# Altium project T1-T0ast.X3.PrjPcb (part 1 of 3)
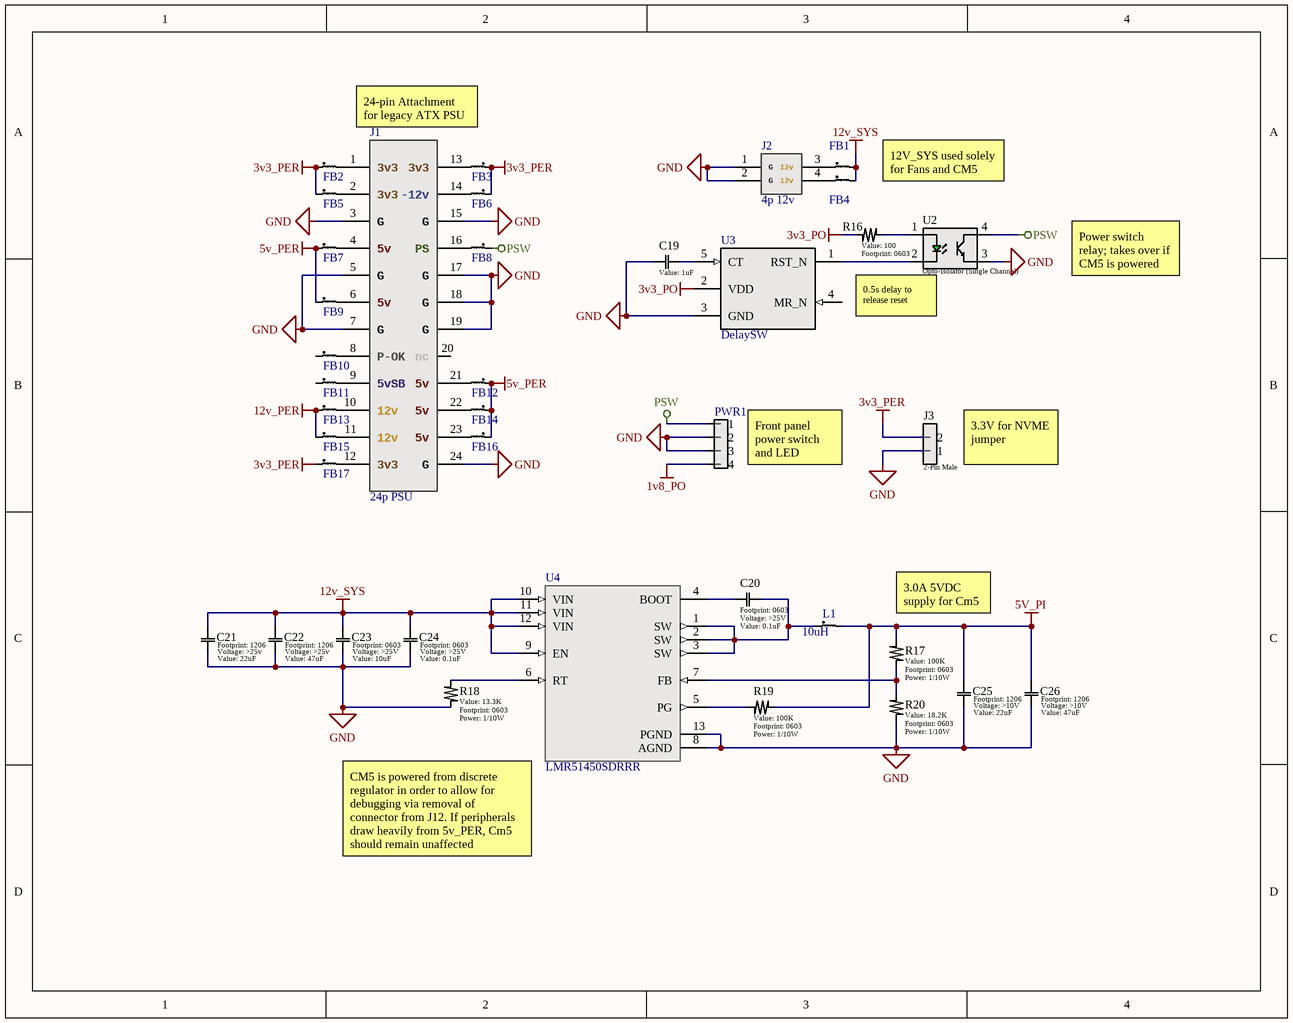
[diagram p0: Power_Regulation.SchDoc]
10 sheets, 431 parts. Net scope: global (net labels, ports and power ports of the same name join across sheets).
Board file: T1-T0ast.PcbDoc
Sheets:
  Power_Regulation.SchDoc
  Docking_Connection.SchDoc
  USB2_Replication.SchDoc
  USB_Audio.SchDoc
  USB_SATA.SchDoc
  RJ45_Ethernet.SchDoc
  HDMI.SchDoc
  SD_Card.SchDoc
  USB3_Replication.SchDoc
  M2_USB_SATA.SchDoc

## Sheet Power_Regulation.SchDoc
size A; SheetNumber: 2; SheetTotal: 11

### Parts
C19  value 1uF  [0603]  (hidden comment: Generic Capacitor)
C20  value 0.1uF  Voltage: >25V  [0603]  (hidden comment: Generic Capacitor)
C21  value 22uF  Voltage: >25v  [1206]  (hidden comment: Generic Capacitor)
C22  value 47uF  Voltage: >25v  [1206]  (hidden comment: Generic Capacitor)
C23  value 10uF  Voltage: >25V  [0603]  (hidden comment: Generic Capacitor)
C24  value 0.1uF  Voltage: >25V  [0603]  (hidden comment: Generic Capacitor)
C25  value 22uF  Voltage: >10V  [1206]  (hidden comment: Generic Capacitor)
C26  value 47uF  Voltage: >10V  [1206]  (hidden comment: Generic Capacitor)
FB1  1206 Ferrite  [1206]  (value not drawn)
FB2  1206 Ferrite  [1206]  (value not drawn)
FB3  1206 Ferrite  [1206]  (value not drawn)
FB4  1206 Ferrite  [1206]  (value not drawn)
FB5  1206 Ferrite  [1206]  (value not drawn)
FB6  1206 Ferrite  [1206]  (value not drawn)
FB7  1206 Ferrite  [1206]  (value not drawn)
FB8  1206 Ferrite  [1206]  (value not drawn)
FB9  1206 Ferrite  [1206]  (value not drawn)
FB10  1206 Ferrite  [1206]  (value not drawn)
FB11  1206 Ferrite  [1206]  (value not drawn)
FB12  1206 Ferrite  [1206]  (value not drawn)
FB13  1206 Ferrite  [1206]  (value not drawn)
FB14  1206 Ferrite  [1206]  (value not drawn)
FB15  1206 Ferrite  [1206]  (value not drawn)
FB16  1206 Ferrite  [1206]  (value not drawn)
FB17  1206 Ferrite  [1206]  (value not drawn)
J1  24p PSU  [CONN_442060007_MOL]
J2  4p 12v  [CON_39281043]
J3  2-Pin Male  [0022057025]
L1  10uH  [SMD 8.2x8.6mm]
PWR1  4-Pin Male Header (0.100" Pitch)  [TSW-104-07-T-S]  (value not drawn)
R16  value 100  [0603]  (hidden comment: Generic Resistor)
R17  value 100K  Power: 1/10W  [0603]  (hidden comment: Generic Resistor)
R18  value 13.3K  Power: 1/10W  [0603]  (hidden comment: Generic Resistor)
R19  value 100K  Power: 1/10W  [0603]  (hidden comment: Generic Resistor)
R20  value 18.2K  Power: 1/10W  [0603]  (hidden comment: Generic Resistor)
U2  Opto-Isolator (Single Channel)  [4-SMD (7.62mm Gull-Wing) Opto-Transistor]
U3  DelaySW  [TSOT-23-5]
U4  LMR51450SDRRR  [WSON-12]

### Nets
1v8_PO: PWR1.4
3v3_PER: FB2.1 FB3.1 FB5.1 FB6.1 FB17.1 J3.2
3v3_PO: R16.1 U3.2(VDD)
5v_PER: FB7.1 FB9.1 FB12.1 FB14.1 FB16.1
5V_PI: C25.1 C26.1 L1.2 R17.2 R19.1
12v_PER: FB13.1 FB15.1
12v_SYS: C21.1 C22.1 C23.1 C24.1 FB1.2 FB4.2 U4.9(EN) U4.10(VIN) U4.11(VIN) U4.12(VIN)
GND: C19.2 C21.2 C22.2 C23.2 C24.2 C25.2 C26.2 J1.3(G) J1.5(G) J1.7(G) J1.15(G) J1.17(G) J1.18(G) J1.19(G) J1.24(G) J2.1(G) J2.2(G) J3.1 PWR1.2 PWR1.3 R18.1 R20.1 U2.3 U3.3(GND) U4.8(AGND) U4.13(PGND)
PSW: FB8.1 PWR1.1 U2.4
NetC19_1: C19.1 U3.5(CT)
NetC20_1: C20.1 U4.4(BOOT)
NetC20_2: C20.2 L1.1 U4.1(SW) U4.2(SW) U4.3(SW)
NetFB1_1: FB1.1 J2.3(12v)
NetFB2_2: FB2.2 J1.1(3v3)
NetFB3_2: FB3.2 J1.13(3v3)
NetFB4_1: FB4.1 J2.4(12v)
NetFB5_2: FB5.2 J1.2(3v3)
NetFB6_2: FB6.2 J1.14(-12v)
NetFB7_2: FB7.2 J1.4(5v)
NetFB8_2: FB8.2 J1.16(PS)
NetFB9_2: FB9.2 J1.6(5v)
NetFB10_2: FB10.2 J1.8(P-OK)
NetFB11_2: FB11.2 J1.9(5vSB)
NetFB12_2: FB12.2 J1.21(5v)
NetFB13_2: FB13.2 J1.10(12v)
NetFB14_2: FB14.2 J1.22(5v)
NetFB15_2: FB15.2 J1.11(12v)
NetFB16_2: FB16.2 J1.23(5v)
NetFB17_2: FB17.2 J1.12(3v3)
NetR16_2: R16.2 U2.1
NetR17_1: R17.1 R20.2 U4.7(FB)
NetR18_2: R18.2 U4.6(RT)
NetR19_2: R19.2 U4.5(PG)
NetU2_2: U2.2 U3.1(RST_N)

Not connected (* = marked no-connect by the designer): FB10 1; FB11 1; J1 20(nc); U3 4(MR_N)

### Notes on the sheet
- 24-pin Attachment for legacy ATX PSU
- 12V_SYS used solely for Fans and CM5
- Power switch relay; takes over if CM5 is powered
- (near U2) 0.5s delay to release reset
- (near PWR1) Front panel power switch and LED
- (near J3) 3.3V for NVME jumper
- (near R17) 3.0A 5VDC supply for Cm5
- (near U4) CM5 is powered from discrete regulator in order to allow for debugging via removal of connector from J12. If peripherals draw heavily from 5v_PER, Cm5 should remain unaffected
- REV
- REVISIONS
- DATE
- DESCRIPTION
- BY
- UNLESS OTHERWISE SPECIFIED, DRAWING DEFINITIONS AND TOLERANCES SHALL BE FOUND UNDER SUPPLIER STANDARDS SS-001. THIS PART AND ALL COMPONENTS OF IT MUST BE RoHS & REACH COMPLIANT. A CERTIFICATE OF COMPLIANCE MUST BE PROVIDED UPON REQUEST.
- ALL INFORMATION ON THIS DOCUMENT IS THE SOLE PROPERTY OF GAMBER-JOHNSON AND SHALL NOT BE COPIED, REPRODUCED, USED OR DISCLOSED IN WHOLE OR IN PART WITHOUT THE WRITTEN CONSENT OF GAMBER-JOHNSON
- TOLERANCES
  .00 ± .060
  .000 ± .020
  .0000 ± .005
  ANGELS ± 1°
- DRAWN BY:
- PROJECT NUMBER:
- SHEET TITLE:
- SHEET
- OF
- DATE:
- LOCATION:
- ASSEMBLY NUMBER
- SIZE
- GAMBER-JOHNSON LLC
  5001 JOERNS DR.
  STEVENS POINT, WI 54481
  +1 (715) 344-5209
- B

### Library data of the parts
C19 = Generic Capacitor: Voltage: 10V; Tolerance: 10%
C20 C23 C24 C26 = Generic Capacitor: Tolerance: 10%
C21 C22 C25 = Generic Capacitor: Tolerance: 20%
FB1-FB17 = HI1206T161R-10: 160 Ohms @ 100MHz 1 Power, Signal Line Ferrite Bead 1206 (3216 Metric) 6A 18mOhm; Manufacturer 1: Laird Steward; DC Resistance (DCR): 18mR; Number of Lines: 1; Impedance: 160R; Supplier 1: Digi-Key; Manufacturer Part Number 1: HI1206T161R-10; RoHS: Yes; Category: Fixed Inductors; Stock 1: 250713; Pricing 1: 1=0.20000, 10=0.15600, 25=0.12920, 50=0.11140, 100=0.10020, 250=0.08464, 500=0.07572, 1000=0.06458 (USD); Mount: Surface Mount; Case/Package: 1206; Weight: 0.0136oz; Case Code (Metric): 3216; Case Code (Imperial): 1206; Core Material: Ferrite; Material: Ferrite; Min Operating Temperature: -40°C; Max Operating Temperature: 125°C; Package Quantity: 1; Packaging: Tape and Reel; Max Current Rating: 6A; Current Rating: 6A; Max DC Current: 6A; Termination: SMD/SMT; Frequency: 100MHz; Test Frequency: 100MHz; Length: 3.2mm; Height: 0.071inch; Width: 0.063inch; Depth: 1.8mm; Lead Free: Lead Free; REACH SVHC: Unknown; ComponentLink1URL: https://datasheet.ciiva.com/22622/1685743-22622771.pdf?src-supplier=Element14; ComponentLink1Description: https://datasheet.ciiva.com/22622/1685743-22622771.pdf?src-supplier=Element14; ComponentLink2URL: https://datasheet.ciiva.com/16714/70065439-16714326.pdf?src-supplier=Allied+Electronics; ComponentLink2Description: https://datasheet.ciiva.com/16714/70065439-16714326.pdf?src-supplier=Allied+Electronics; Supplier Part Number 1: 240-2411-1-ND; LCSC PN: C2926396
J1 = 442060007: Connector Header Through Hole 24 position 0.165" (4.20mm); Mfr_Name: Molex Connector Corporation; RefDes: RefDes; Type: Type; Supplier 1: Mouser; Supplier Part Number 1: 538-44206-0007; LCSC PN: C7541562
J2 = 39281043: Connector Header Through Hole 4 position 0.165" (4.20mm); Mfr_Name: Molex Connector Corporation; RefDes: RefDes; Type: Type; Supplier 1: Avnet; Supplier Part Number 1: 0039281043; LCSC PN: C2845777
J3 = 0022057025: Conn Shrouded Header (4 Sides) HDR 2 POS 2.5mm Solder RA Thru-Hole SPOX™ Bag; Manufacturer 1: Molex; Number of Poles: 2; Voltage Rating: 250V; Contact Resistance: 20mR; Max Voltage Rating (DC): 250.25kV; Max Voltage Rating (AC): 125V; Current Rating: 3A; Insulation Resistance: 1GR; Connector Type: Male Pin; Shrouded: Yes (With); Test Voltage: 1kV; Glow Wire Compliant: Non-compliant; Supplier 1: RSComponents; Manufacturer Part Number 1: 22-05-7025; RoHS: Yes; Category: Headers and Wire Housings; Stock 1: 1440; Pricing 1: 10=0.40100, 250=0.36000, 1000=0.24900, 5000=0.22200, 10000=0.20700 (USD); Mount: Through Hole,Surface Mount; Contact Plating: Tin,Copper; Contact Material: Brass,Bronze; Housing Color: Natural; Housing Material: Nylon; Color: Natural; Material: Nylon,Polyamide; Insulation Material: Nylon; Min Operating Temperature: -40°C; Max Operating Temperature: 105°C; Packaging: Bulk; Gender: Male; Number of Rows: 1; Termination: Solder; Number of Contacts: 2; Orientation: Right Angle; Package Quantity: 1; Voltage Rating (AC): 250V; Number of Positions: 2; Working Voltage: 250V; Voltage Rating (DC): 250V; Number of Circuits: 2; Contact Gender: Male; Series: SPOX™ 5268; Contact Type: Male Pin; Length: 7.65mm; Height: 5.7mm; Pitch: 2.5mm; Depth: 5.1mm; Lead Pitch: 2.5mm; Contact Mating Length: 0.138inch; Radiation Hardening: No; RoHS Compliant: Yes; REACH SVHC: Unknown; Lead Free: Lead Free; Flammability Rating: UL94 V-0; ComponentLink1URL: https://datasheet.ciiva.com/711/022057025-sd-711958.pdf?src-supplier=Digi-Key; ComponentLink1Description: https://datasheet.ciiva.com/711/022057025-sd-711958.pdf?src-supplier=Digi-Key; ComponentLink2URL: https://datasheet.ciiva.com/25265/1766960-25265813.pdf?src-supplier=Newark; ComponentLink2Description: https://datasheet.ciiva.com/25265/1766960-25265813.pdf?src-supplier=Newark; ComponentLink3URL: https://datasheet.ciiva.com/5155/0022057025-pcb-headers-158480-5155683.pdf?src-supplier=Mouser; ComponentLink3Description: https://datasheet.ciiva.com/5155/0022057025-pcb-headers-158480-5155683.pdf?src-supplier=Mouser; ComponentLink4URL: https://datasheet.ciiva.com/19461/2017869-19461071.pdf?src-supplier=Jameco; ComponentLink4Description: https://datasheet.ciiva.com/19461/2017869-19461071.pdf?src-supplier=Jameco; ComponentLink5URL: https://datasheet.ciiva.com/11747/0900766b80da772b-11747276.pdf?src-supplier=RSComponents; ComponentLink5Description: https://datasheet.ciiva.com/11747/0900766b80da772b-11747276.pdf?src-supplier=RSComponents; ComponentLink6URL: https://datasheet.ciiva.com/7920/1877911-7920684.pdf?src-supplier=Element14; ComponentLink6Description: https://datasheet.ciiva.com/7920/1877911-7920684.pdf?src-supplier=Element14; ComponentLink7URL: https://datasheet.ciiva.com/9468/0022057025-pcb-headers-9468379.pdf?src-supplier=Avnet; ComponentLink7Description: https://datasheet.ciiva.com/9468/0022057025-pcb-headers-9468379.pdf?src-supplier=Avnet; Supplier Part Number 1: 6878086; LCSC PN: C918490
L1 = IHLP3232DZER100M5A: 5.1A 10uH ±20% 5.2A - Power Inductor; Mfr_Name: Vishay; Type: DEV; Copyright: Copyright (C) 2023 Ultra Librarian. All rights reserved.; Manufacturer_Part_Number: IHLP3232DZER100M5A; RefDes: RefDes; LCSC PN: C2051768; Supplier 1: Mouser
PWR1 = TSW-104-07-T-S: Connector Header Through Hole 4 position 0.100" (2.54mm); Manufacturer 1: Samtec; Manufacturer Part Number 1: MTSW-104-07-T-S-170; Number of Contacts: 4; Supplier 1: Avnet; RoHS: Yes; Category: Connectors; Mount: Through Hole; Contact Plating: Tin; Contact Material: Bronze; Min Operating Temperature: -55°C; Max Operating Temperature: 105°C; Number of Rows: 1; Termination: Solder; Gender: Male; Packaging: Bulk; Orientation: Vertical; Pitch: 2.54mm; Radiation Hardening: No; RoHS Compliant: Yes; Lead Free: Lead Free; ComponentLink1URL: http://www.samtec.com/documents/webfiles/pdf/HMTSW.PDF?src-supplier=Avnet; ComponentLink1Description: http://www.samtec.com/documents/webfiles/pdf/HMTSW.PDF?src-supplier=Avnet; Supplier Part Number 1: MTSW-104-07-T-S-170
R16 = Generic Resistor: Tolerance: 1%; Power: 1/10W
R17-R20 = Generic Resistor: Tolerance: 1%
U2 = LTV-816S: LTV Series Single Channel 80 V 5000 Vrms Transistor Output Optocoupler SMT-DIP-4; Manufacturer: Vishay Lite-On; Manufacturer Part Number: LTV-816S-TA1; Number of Channels: 1; Forward Voltage: 1.4V; Collector Emitter Voltage (VCEO): 80V; Rise Time: 18000ns; Output Current per Channel: 50mA; Collector Emitter Saturation Voltage: 200mV; Current Transfer Ratio: 320%; Isolation Voltage: 5kV; Input Type: DC; Max Power Dissipation: 200mW; Reverse Breakdown Voltage: 6V; Supplier 1: Digi-Key; RoHS: Yes; Category: Optocouplers; Stock 1: 2; Pricing 1: 1=0.45000, 10=0.27600, 100=0.15870 (USD); Mount: Surface Mount; Case/Package: SMD/SMT; Number of Pins: 4; Min Operating Temperature: -50°C; Max Operating Temperature: 110°C; Max Output Voltage: 80V; Packaging: Tape and Reel; Forward Current: 50mA; Fall Time: 18000ns; Max Input Current: 50mA; Collector-emitter Voltage-Max: 200mV; Series: -; Max Collector Current: 50mA; Number of Elements: 1; Power Dissipation: 200mW; Package Quantity: 1000; Output Voltage: 80V; Number of Circuits: 1; Isolation Voltage-Max: 5kV; Radiation Hardening: No; RoHS Compliant: Yes; Lead Free: Lead Free; ComponentLink1URL: https://datasheet.ciiva.com/15119/getdatasheetpartid-317372-15119066.pdf?src-supplier=Verical; ComponentLink1Description: https://datasheet.ciiva.com/15119/getdatasheetpartid-317372-15119066.pdf?src-supplier=Verical; ComponentLink2URL: https://datasheet.ciiva.com/6573/s-110-ltv-816826846m-s-s-ta-s-ta1-s-tpseries-6573992.pdf?src-supplier=Digi-Key; ComponentLink2Description: https://datasheet.ciiva.com/6573/s-110-ltv-816826846m-s-s-ta-s-ta1-s-tpseries-6573992.pdf?src-supplier=Digi-Key; ComponentLink3URL: https://datasheet.ciiva.com/6573/s-110-ltv-816826846m-s-s-ta-s-ta1-s-tpseries-6573991.pdf?src-supplier=Digi-Key; ComponentLink3Description: https://datasheet.ciiva.com/6573/s-110-ltv-816826846m-s-s-ta-s-ta1-s-tpseries-6573991.pdf?src-supplier=Digi-Key; ComponentLink4URL: https://datasheet.ciiva.com/6573/s-110-ltv-816826846m-s-s-ta-s-ta1-s-tpseries-6573993.pdf?src-supplier=Digi-Key; ComponentLink4Description: https://datasheet.ciiva.com/6573/s-110-ltv-816826846m-s-s-ta-s-ta1-s-tpseries-6573993.pdf?src-supplier=Digi-Key; Supplier Part Number 1: 160-1892-1-ND; LCSC PN: C92647
U3 = TPS3840DL22DBVR: Supervisor Open Drain or Open Collector 1 Channel SOT-23-5 / 2.2V Threshold; Mfr_Name: Texas Instruments; TYPE: TYPE; RefDes: RefDes; LCSC PN: C2867913; Supplier 1: Mouser; Supplier Part Number 1: 595-TPS3840DL22DBVR
U4 = LMR51450SDRRR: 36-V, 5-A synchronous buck converter; MF: Texas Instruments; SnapEDA_Link: https://www.snapeda.com/parts/LMR51450SDRRR/Texas+Instruments/view-part/?ref=snap; Package: WSON-12 Texas Instruments; Value: *; MP: LMR51450SDRRR; Check_prices: https://www.snapeda.com/parts/LMR51450SDRRR/Texas+Instruments/view-part/?ref=eda; LCSC PN: C6890985

## Sheet Docking_Connection.SchDoc
size B; SheetNumber: 3; SheetTotal: 11
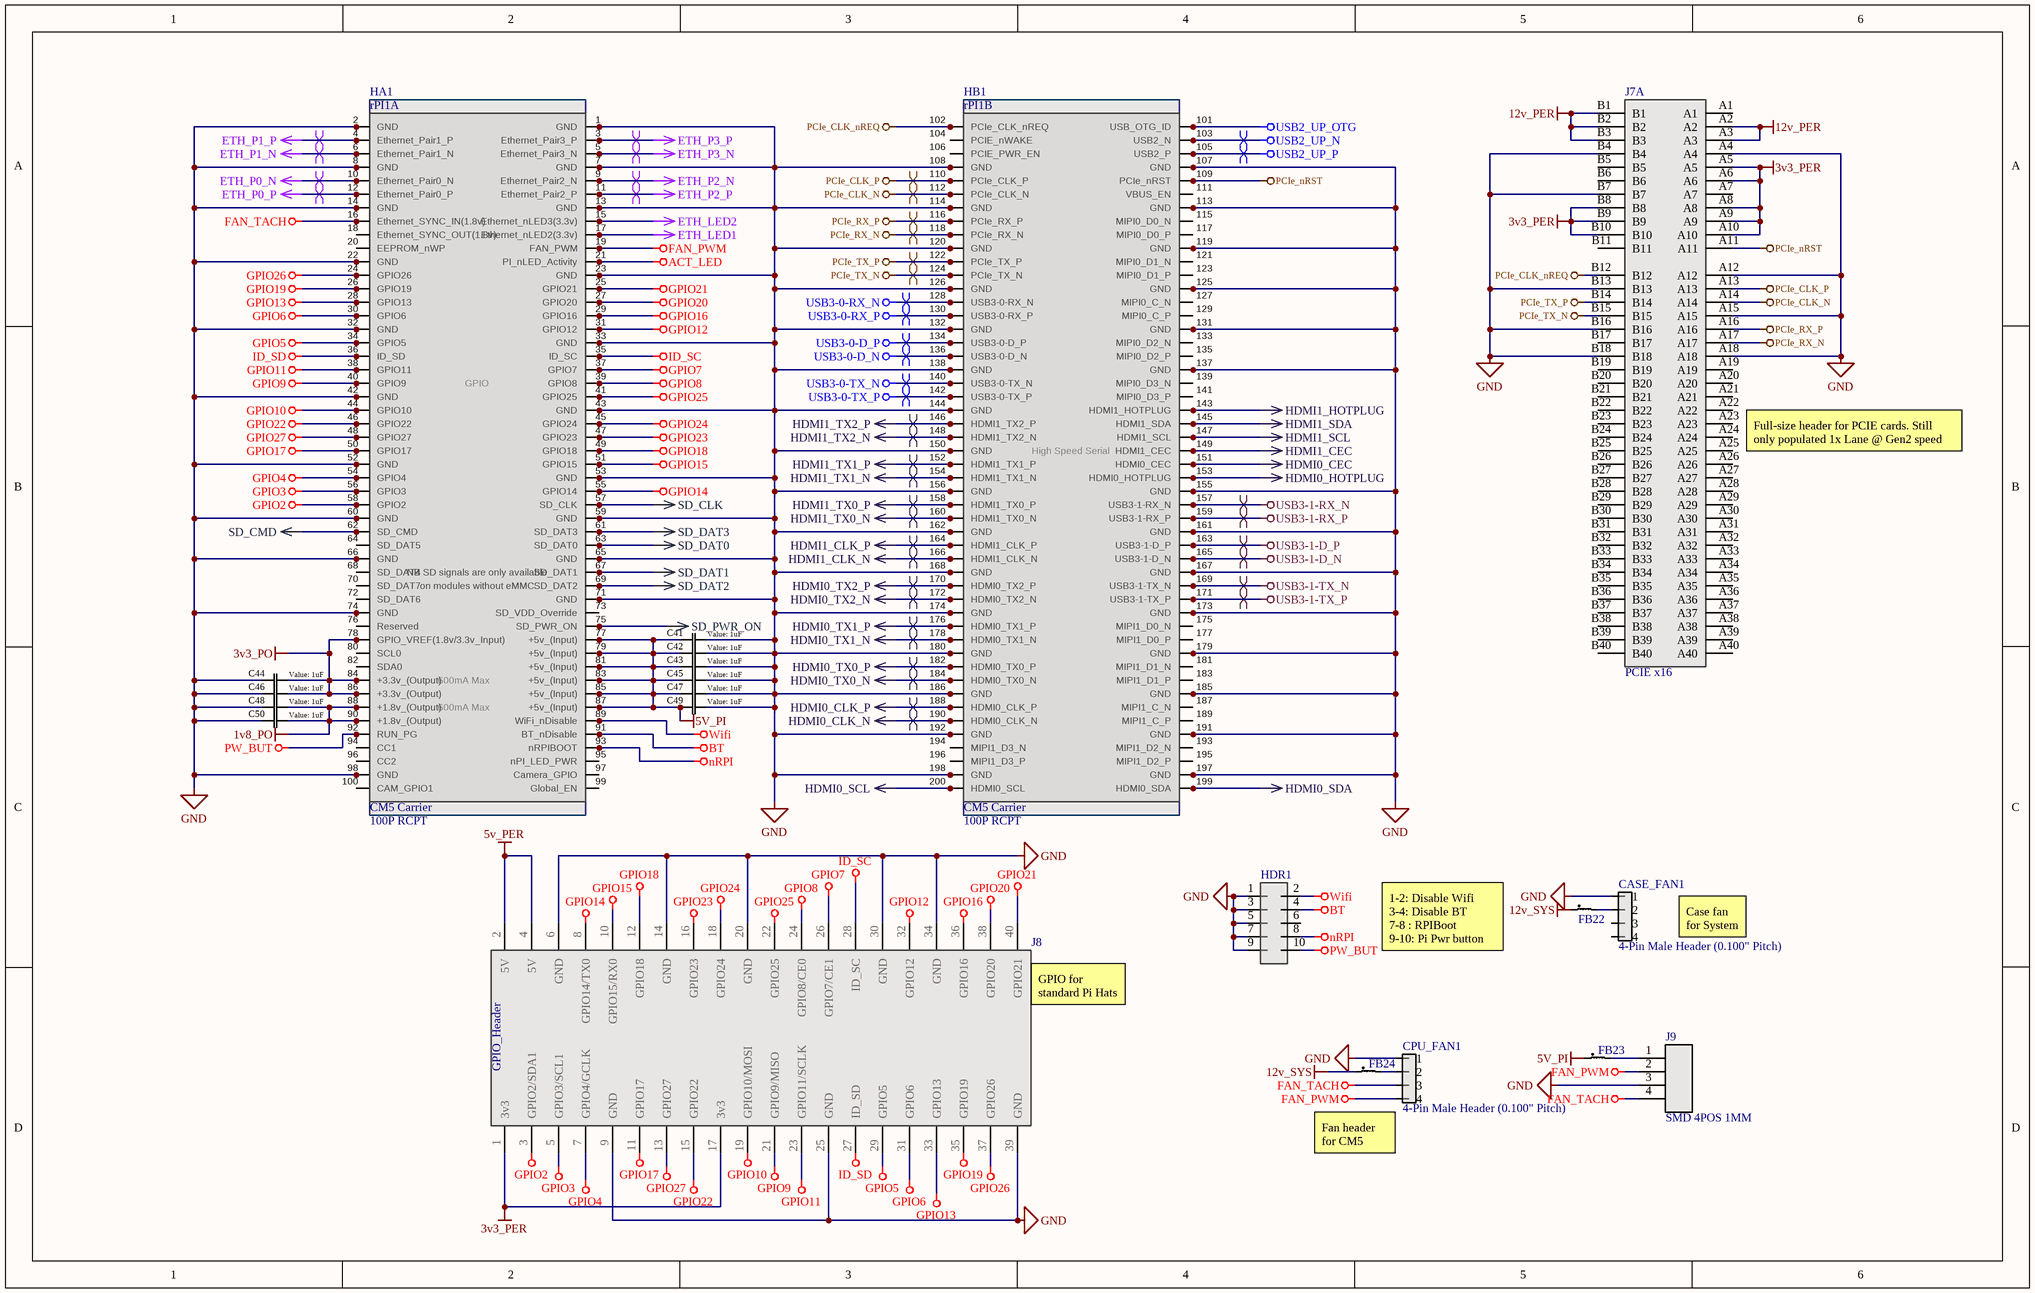
[diagram p1: Docking_Connection.SchDoc]

### Parts
C41  value 1uF  [0603]  (hidden comment: Generic Capacitor)
C42  value 1uF  [0603]  (hidden comment: Generic Capacitor)
C43  value 1uF  [0603]  (hidden comment: Generic Capacitor)
C44  value 1uF  [0603]  (hidden comment: Generic Capacitor)
C45  value 1uF  [0603]  (hidden comment: Generic Capacitor)
C46  value 1uF  [0603]  (hidden comment: Generic Capacitor)
C47  value 1uF  [0603]  (hidden comment: Generic Capacitor)
C48  value 1uF  [0603]  (hidden comment: Generic Capacitor)
C49  value 1uF  [0603]  (hidden comment: Generic Capacitor)
C50  value 1uF  [0603]  (hidden comment: Generic Capacitor)
CASE_FAN1  4-Pin Male Header (0.100" Pitch)  [TSW-104-07-T-S]
CPU_FAN1  4-Pin Male Header (0.100" Pitch)  [TSW-104-07-T-S]
FB22  0603 Ferrite  [0603]  (value not drawn)
FB23  0603 Ferrite  [0603]  (value not drawn)
FB24  0603 Ferrite  [0603]  (value not drawn)
HA1  100P RCPT  [DF40HC(3.0)-100DS-0.4V(51)]
HB1  100P RCPT  [DF40HC(3.0)-100DS-0.4V(51)]
HDR1  10pinMobo  [10pinMobo]  (value not drawn)
J7  PCIE x16  [10018783-10203TLF]  (part A of 2)
J8  rPi Zero Carrier  [rPiHeader]  (value not drawn)
J9  SMD 4POS 1MM  [CONN4_BM04B-SRSS_JST]
rPI1  CM5 Carrier  [CM4-FTPD]  (parts A,B of 2)

### Nets
1v8_PO: C48.1 C50.1 HA1.88 HA1.90 rPI1.88(+1.8v_(Output)) rPI1.90(+1.8v_(Output))
3v3_PER: J7.A5 J7.A6 J7.A8 J7.A9 J7.A10 J7.B8 J7.B9 J7.B10 J8.1(3v3) J8.17(3v3)
3v3_PO: C44.1 C46.1 HA1.78 HA1.84 HA1.86 rPI1.78(GPIO_VREF(1.8v/3.3v_Input)) rPI1.84(+3.3v_(Output)) rPI1.86(+3.3v_(Output))
5v_PER: J8.2(5V) J8.4(5V)
5V_PI: C41.2 C42.2 C43.2 C45.2 C47.2 C49.2 FB23.1 HA1.77 HA1.79 HA1.81 HA1.83 HA1.85 HA1.87 rPI1.77(+5v_(Input)) rPI1.79(+5v_(Input)) rPI1.81(+5v_(Input)) rPI1.83(+5v_(Input)) rPI1.85(+5v_(Input)) rPI1.87(+5v_(Input))
12v_PER: J7.A2 J7.A3 J7.B1 J7.B2 J7.B3
12v_SYS: FB22.1 FB24.1
ACT_LED: HA1.21 rPI1.21(PI_nLED_Activity)
BT: HA1.91 HDR1.4 rPI1.91(BT_nDisable)
ETH_LED1: HA1.17 rPI1.17(Ethernet_nLED2(3.3v))
ETH_LED2: HA1.15 rPI1.15(Ethernet_nLED3(3.3v))
ETH_P0_N: HA1.10 rPI1.10(Ethernet_Pair0_N)
ETH_P0_P: HA1.12 rPI1.12(Ethernet_Pair0_P)
ETH_P1_N: HA1.6 rPI1.6(Ethernet_Pair1_N)
ETH_P1_P: HA1.4 rPI1.4(Ethernet_Pair1_P)
ETH_P2_N: HA1.9 rPI1.9(Ethernet_Pair2_N)
ETH_P2_P: HA1.11 rPI1.11(Ethernet_Pair2_P)
ETH_P3_N: HA1.5 rPI1.5(Ethernet_Pair3_N)
ETH_P3_P: HA1.3 rPI1.3(Ethernet_Pair3_P)
FAN_PWM: CPU_FAN1.4 HA1.19 J9.2 rPI1.19(FAN_PWM)
FAN_TACH: CPU_FAN1.3 HA1.16 J9.4 rPI1.16(Ethernet_SYNC_IN(1.8v))
GND: C41.1 C42.1 C43.1 C44.2 C45.1 C46.2 C47.1 C48.2 C49.1 C50.2 CASE_FAN1.1 CPU_FAN1.1 HA1.1 HA1.2 HA1.7 HA1.8 HA1.13 HA1.14 HA1.22 HA1.23 HA1.32 HA1.33 HA1.42 HA1.43 HA1.52 HA1.53 HA1.59 HA1.60 HA1.65 HA1.66 HA1.71 HA1.74 HA1.98 HB1.7 HB1.8 HB1.13 HB1.14 HB1.19 HB1.20 HB1.25 HB1.26 HB1.31 HB1.32 HB1.37 HB1.38 HB1.44 HB1.50 HB1.55 HB1.56 HB1.61 HB1.62 HB1.67 HB1.68 HB1.73 HB1.74 HB1.79 HB1.80 HB1.85 HB1.86 HB1.91 HB1.92 HB1.97 HB1.98 HDR1.1 HDR1.3 HDR1.5 HDR1.7 HDR1.9 J7.A4 J7.A12 J7.A15 J7.A18 J7.B4 J7.B7 J7.B13 J7.B16 J7.B18 J8.6(GND) J8.9(GND) J8.14(GND) J8.20(GND) J8.25(GND) J8.30(GND) J8.34(GND) J8.39(GND) J9.3 rPI1.1(GND) rPI1.2(GND) rPI1.7(GND) rPI1.8(GND) rPI1.13(GND) rPI1.14(GND) rPI1.22(GND) rPI1.23(GND) rPI1.32(GND) rPI1.33(GND) rPI1.42(GND) rPI1.43(GND) rPI1.52(GND) rPI1.53(GND) rPI1.59(GND) rPI1.60(GND) rPI1.65(GND) rPI1.66(GND) rPI1.71(GND) rPI1.74(GND) rPI1.98(GND) rPI1.107(GND) rPI1.108(GND) rPI1.113(GND) rPI1.114(GND) rPI1.119(GND) rPI1.120(GND) rPI1.125(GND) rPI1.126(GND) rPI1.131(GND) rPI1.132(GND) rPI1.137(GND) rPI1.138(GND) rPI1.144(GND) rPI1.150(GND) rPI1.155(GND) rPI1.156(GND) rPI1.161(GND) rPI1.162(GND) rPI1.167(GND) rPI1.168(GND) rPI1.173(GND) rPI1.174(GND) rPI1.179(GND) rPI1.180(GND) rPI1.185(GND) rPI1.186(GND) rPI1.191(GND) rPI1.192(GND) rPI1.197(GND) rPI1.198(GND)
GPIO2: HA1.58 J8.3(GPIO2/SDA1) rPI1.58(GPIO2)
GPIO3: HA1.56 J8.5(GPIO3/SCL1) rPI1.56(GPIO3)
GPIO4: HA1.54 J8.7(GPIO4/GCLK) rPI1.54(GPIO4)
GPIO5: HA1.34 J8.29(GPIO5) rPI1.34(GPIO5)
GPIO6: HA1.30 J8.31(GPIO6) rPI1.30(GPIO6)
GPIO7: HA1.37 J8.26(GPIO7/CE1) rPI1.37(GPIO7)
GPIO8: HA1.39 J8.24(GPIO8/CE0) rPI1.39(GPIO8)
GPIO9: HA1.40 J8.21(GPIO9/MISO) rPI1.40(GPIO9)
GPIO10: HA1.44 J8.19(GPIO10/MOSI) rPI1.44(GPIO10)
GPIO11: HA1.38 J8.23(GPIO11/SCLK) rPI1.38(GPIO11)
GPIO12: HA1.31 J8.32(GPIO12) rPI1.31(GPIO12)
GPIO13: HA1.28 J8.33(GPIO13) rPI1.28(GPIO13)
GPIO14: HA1.55 J8.8(GPIO14/TX0) rPI1.55(GPIO14)
GPIO15: HA1.51 J8.10(GPIO15/RX0) rPI1.51(GPIO15)
GPIO16: HA1.29 J8.36(GPIO16) rPI1.29(GPIO16)
GPIO17: HA1.50 J8.11(GPIO17) rPI1.50(GPIO17)
GPIO18: HA1.49 J8.12(GPIO18) rPI1.49(GPIO18)
GPIO19: HA1.26 J8.35(GPIO19) rPI1.26(GPIO19)
GPIO20: HA1.27 J8.38(GPIO20) rPI1.27(GPIO20)
GPIO21: HA1.25 J8.40(GPIO21) rPI1.25(GPIO21)
GPIO22: HA1.46 J8.15(GPIO22) rPI1.46(GPIO22)
GPIO23: HA1.47 J8.16(GPIO23) rPI1.47(GPIO23)
GPIO24: HA1.45 J8.18(GPIO24) rPI1.45(GPIO24)
GPIO25: HA1.41 J8.22(GPIO25) rPI1.41(GPIO25)
GPIO26: HA1.24 J8.37(GPIO26) rPI1.24(GPIO26)
GPIO27: HA1.48 J8.13(GPIO27) rPI1.48(GPIO27)
HDMI0_CEC: HB1.51 rPI1.151(HDMI0_CEC)
HDMI0_CLK_N: HB1.90 rPI1.190(HDMI0_CLK_N)
HDMI0_CLK_P: HB1.88 rPI1.188(HDMI0_CLK_P)
HDMI0_HOTPLUG: HB1.53 rPI1.153(HDMI0_HOTPLUG)
HDMI0_SCL: HB1.100 rPI1.200(HDMI0_SCL)
HDMI0_SDA: HB1.99 rPI1.199(HDMI0_SDA)
HDMI0_TX0_N: HB1.84 rPI1.184(HDMI0_TX0_N)
HDMI0_TX0_P: HB1.82 rPI1.182(HDMI0_TX0_P)
HDMI0_TX1_N: HB1.78 rPI1.178(HDMI0_TX1_N)
HDMI0_TX1_P: HB1.76 rPI1.176(HDMI0_TX1_P)
HDMI0_TX2_N: HB1.72 rPI1.172(HDMI0_TX2_N)
HDMI0_TX2_P: HB1.70 rPI1.170(HDMI0_TX2_P)
HDMI1_CEC: HB1.49 rPI1.149(HDMI1_CEC)
HDMI1_CLK_N: HB1.66 rPI1.166(HDMI1_CLK_N)
HDMI1_CLK_P: HB1.64 rPI1.164(HDMI1_CLK_P)
HDMI1_HOTPLUG: HB1.43 rPI1.143(HDMI1_HOTPLUG)
HDMI1_SCL: HB1.47 rPI1.147(HDMI1_SCL)
HDMI1_SDA: HB1.45 rPI1.145(HDMI1_SDA)
HDMI1_TX0_N: HB1.60 rPI1.160(HDMI1_TX0_N)
HDMI1_TX0_P: HB1.58 rPI1.158(HDMI1_TX0_P)
HDMI1_TX1_N: HB1.54 rPI1.154(HDMI1_TX1_N)
HDMI1_TX1_P: HB1.52 rPI1.152(HDMI1_TX1_P)
HDMI1_TX2_N: HB1.48 rPI1.148(HDMI1_TX2_N)
HDMI1_TX2_P: HB1.46 rPI1.146(HDMI1_TX2_P)
ID_SC: HA1.35 J8.28(ID_SC) rPI1.35(ID_SC)
ID_SD: HA1.36 J8.27(ID_SD) rPI1.36(ID_SD)
nRPI: HA1.93 HDR1.8 rPI1.93(nRPIBOOT)
PCIe_CLK_N: HB1.12 J7.A14 rPI1.112(PCIe_CLK_N)
PCIe_CLK_nREQ: HB1.2 J7.B12 rPI1.102(PCIe_CLK_nREQ)
PCIe_CLK_P: HB1.10 J7.A13 rPI1.110(PCIe_CLK_P)
PCIe_nRST: HB1.9 J7.A11 rPI1.109(PCIe_nRST)
PCIe_RX_N: HB1.18 J7.A17 rPI1.118(PCIe_RX_N)
PCIe_RX_P: HB1.16 J7.A16 rPI1.116(PCIe_RX_P)
PCIe_TX_N: HB1.24 J7.B15 rPI1.124(PCIe_TX_N)
PCIe_TX_P: HB1.22 J7.B14 rPI1.122(PCIe_TX_P)
PW_BUT: HA1.92 HDR1.10 rPI1.92(RUN_PG)
SD_CLK: HA1.57 rPI1.57(SD_CLK)
SD_CMD: HA1.62 rPI1.62(SD_CMD)
SD_DAT0: HA1.63 rPI1.63(SD_DAT0)
SD_DAT1: HA1.67 rPI1.67(SD_DAT1)
SD_DAT2: HA1.69 rPI1.69(SD_DAT2)
SD_DAT3: HA1.61 rPI1.61(SD_DAT3)
SD_PWR_ON: HA1.75 rPI1.75(SD_PWR_ON)
USB2_UP_N: HB1.3 rPI1.103(USB2_N)
USB2_UP_OTG: HB1.1 rPI1.101(USB_OTG_ID)
USB2_UP_P: HB1.5 rPI1.105(USB2_P)
USB3-0-D_N: HB1.36 rPI1.136(USB3-0-D_N)
USB3-0-D_P: HB1.34 rPI1.134(USB3-0-D_P)
USB3-0-RX_N: HB1.28 rPI1.128(USB3-0-RX_N)
USB3-0-RX_P: HB1.30 rPI1.130(USB3-0-RX_P)
USB3-0-TX_N: HB1.40 rPI1.140(USB3-0-TX_N)
USB3-0-TX_P: HB1.42 rPI1.142(USB3-0-TX_P)
USB3-1-D_N: HB1.65 rPI1.165(USB3-1-D_N)
USB3-1-D_P: HB1.63 rPI1.163(USB3-1-D_P)
USB3-1-RX_N: HB1.57 rPI1.157(USB3-1-RX_N)
USB3-1-RX_P: HB1.59 rPI1.159(USB3-1-RX_P)
USB3-1-TX_N: HB1.69 rPI1.169(USB3-1-TX_N)
USB3-1-TX_P: HB1.71 rPI1.171(USB3-1-TX_P)
Wifi: HA1.89 HDR1.2 rPI1.89(WiFi_nDisable)
NetCASE_FAN1_2: CASE_FAN1.2 FB22.2
NetCPU_FAN1_2: CPU_FAN1.2 FB24.2
NetFB23_2: FB23.2 J9.1
NetHA1_18: HA1.18 rPI1.18(Ethernet_SYNC_OUT(1.8v))
NetHA1_20: HA1.20 rPI1.20(EEPROM_nWP)
NetHA1_64: HA1.64 rPI1.64(SD_DAT5)
NetHA1_68: HA1.68 rPI1.68(SD_DAT4)
NetHA1_70: HA1.70 rPI1.70(SD_DAT7)
NetHA1_72: HA1.72 rPI1.72(SD_DAT6)
NetHA1_73: HA1.73 rPI1.73(SD_VDD_Override)
NetHA1_76: HA1.76 rPI1.76(Reserved)
NetHA1_80: HA1.80 rPI1.80(SCL0)
NetHA1_82: HA1.82 rPI1.82(SDA0)
NetHA1_94: HA1.94 rPI1.94(CC1)
NetHA1_95: HA1.95 rPI1.95(nPI_LED_PWR)
NetHA1_96: HA1.96 rPI1.96(CC2)
NetHA1_97: HA1.97 rPI1.97(Camera_GPIO)
NetHA1_99: HA1.99 rPI1.99(Global_EN)
NetHA1_100: HA1.100 rPI1.100(CAM_GPIO1)
NetHB1_4: HB1.4 rPI1.104(PCIE_nWAKE)
NetHB1_6: HB1.6 rPI1.106(PCIE_PWR_EN)
NetHB1_11: HB1.11 rPI1.111(VBUS_EN)
NetHB1_15: HB1.15 rPI1.115(MIPI0_D0_N)
NetHB1_17: HB1.17 rPI1.117(MIPI0_D0_P)
NetHB1_21: HB1.21 rPI1.121(MIPI0_D1_N)
NetHB1_23: HB1.23 rPI1.123(MIPI0_D1_P)
NetHB1_27: HB1.27 rPI1.127(MIPI0_C_N)
NetHB1_29: HB1.29 rPI1.129(MIPI0_C_P)
NetHB1_33: HB1.33 rPI1.133(MIPI0_D2_N)
NetHB1_35: HB1.35 rPI1.135(MIPI0_D2_P)
NetHB1_39: HB1.39 rPI1.139(MIPI0_D3_N)
NetHB1_41: HB1.41 rPI1.141(MIPI0_D3_P)
NetHB1_75: HB1.75 rPI1.175(MIPI1_D0_N)
NetHB1_77: HB1.77 rPI1.177(MIPI1_D0_P)
NetHB1_81: HB1.81 rPI1.181(MIPI1_D1_N)
NetHB1_83: HB1.83 rPI1.183(MIPI1_D1_P)
NetHB1_87: HB1.87 rPI1.187(MIPI1_C_N)
NetHB1_89: HB1.89 rPI1.189(MIPI1_C_P)
NetHB1_93: HB1.93 rPI1.193(MIPI1_D2_N)
NetHB1_94: HB1.94 rPI1.194(MIPI1_D3_N)
NetHB1_95: HB1.95 rPI1.195(MIPI1_D2_P)
NetHB1_96: HB1.96 rPI1.196(MIPI1_D3_P)

Not connected (* = marked no-connect by the designer): CASE_FAN1 3 4; HDR1 6; J7 A1 A7 A19 A20 A21 A22 A23 A24 A25 A26 A27 A28 A29 A30 A31 A32 A33 A34 A35 A36 A37 A38 A39 A40 B5 B6 B11 B17 B19 B20 B21 B22 B23 B24 B25 B26 B27 B28 B29 B30 B31 B32 B33 B34 B35 B36 B37 B38 B39 B40

### Layout directives
differential pair: ETH_P0_N, ETH_P0_P, ETH_P1_N, ETH_P1_P, ETH_P2_N, ETH_P2_P, ETH_P3_N, ETH_P3_P, HDMI0_CLK_N, HDMI0_CLK_P, HDMI0_TX0_N, HDMI0_TX0_P, HDMI0_TX1_N, HDMI0_TX1_P, HDMI0_TX2_N, HDMI0_TX2_P, HDMI1_CLK_N, HDMI1_CLK_P, HDMI1_TX0_N, HDMI1_TX0_P, HDMI1_TX1_N, HDMI1_TX1_P, HDMI1_TX2_N, HDMI1_TX2_P, PCIe_CLK_N, PCIe_CLK_P, PCIe_RX_N, PCIe_RX_P, PCIe_TX_N, PCIe_TX_P, USB2_UP_N, USB2_UP_P, USB3-0-D_N, USB3-0-D_P, USB3-0-RX_N, USB3-0-RX_P, USB3-0-TX_N, USB3-0-TX_P, USB3-1-D_N, USB3-1-D_P, USB3-1-RX_N, USB3-1-RX_P, USB3-1-TX_N, USB3-1-TX_P

### Notes on the sheet
- (near J7) Full-size header for PCIE cards. Still only populated 1x Lane @ Gen2 speed
- 1-2: Disable Wifi
  3-4: Disable BT
  7-8 : RPIBoot
  9-10: Pi Pwr button
- Case fan for System
- (near J8) GPIO for standard Pi Hats
- (near CPU_FAN1) Fan header for CM5
- REV
- REVISIONS
- DATE
- DESCRIPTION
- BY
- UNLESS OTHERWISE SPECIFIED, DRAWING DEFINITIONS AND TOLERANCES SHALL BE FOUND UNDER SUPPLIER STANDARDS SS-001. THIS PART AND ALL COMPONENTS OF IT MUST BE RoHS & REACH COMPLIANT. A CERTIFICATE OF COMPLIANCE MUST BE PROVIDED UPON REQUEST.
- ALL INFORMATION ON THIS DOCUMENT IS THE SOLE PROPERTY OF GAMBER-JOHNSON AND SHALL NOT BE COPIED, REPRODUCED, USED OR DISCLOSED IN WHOLE OR IN PART WITHOUT THE WRITTEN CONSENT OF GAMBER-JOHNSON
- TOLERANCES
  .00 ± .060
  .000 ± .020
  .0000 ± .005
  ANGELS ± 1°
- DRAWN BY:
- PROJECT NUMBER:
- SHEET TITLE:
- SHEET
- OF
- DATE:
- LOCATION:
- ASSEMBLY NUMBER
- SIZE
- GAMBER-JOHNSON LLC
  5001 JOERNS DR.
  STEVENS POINT, WI 54481
  +1 (715) 344-5209
- B
- (in symbol RP-CM5, part A) GPIO; NB SD signals are only available; on modules without eMMC; 600mA Max
- (in symbol RP-CM5, part B) High Speed Serial
- (in symbol RP-Zero_1) GPIO_Header
- (in symbol RP-Zero, part A) GPIO_Header

### Library data of the parts
C41-C50 = Generic Capacitor: Voltage: 6V; Tolerance: 5%
CASE_FAN1 CPU_FAN1 = TSW-104-07-T-S: as PWR1 on sheet Power_Regulation; Supplier 1: Avnet; RoHS: Yes; Category: Connectors; Mount: Through Hole; Contact Plating: Tin; Contact Material: Bronze; Min Operating Temperature: -55°C; Max Operating Temperature: 105°C; Number of Rows: 1; Termination: Solder; Gender: Male; Packaging: Bulk; Orientation: Vertical; Pitch: 2.54mm; Radiation Hardening: No; RoHS Compliant: Yes; Lead Free: Lead Free; ComponentLink1URL: http://www.samtec.com/documents/webfiles/pdf/HMTSW.PDF?src-supplier=Avnet; ComponentLink1Description: http://www.samtec.com/documents/webfiles/pdf/HMTSW.PDF?src-supplier=Avnet; Supplier Part Number 1: MTSW-104-07-T-S-170
FB22-FB24 = PE-0603FB121ST: 120 Ohms @ 100 MHz 1 Signal Line Ferrite Bead 0603 (1608 Metric) 500mA 180mOhm; Manufacturer: Pulse; Number of Lines: 1; DC Resistance (DCR): 180mR; Supplier 1: Digi-Key; Supplier Part Number 1: 553-2382-1-ND; Manufacturer Part Number: PE-0603FB121ST; RoHS: Yes; Category: Inductors; Stock 1: 6181; Pricing 1: 1=0.10000, 10=0.04400, 25=0.03920, 50=0.03580, 100=0.03220, 250=0.02360, 500=0.01716, 1000=0.01680 (USD); Mount: Surface Mount; Case/Package: 0603; Case Code (Metric): 1608; Case Code (Imperial): 0603; Min Operating Temperature: -40°C; Max Operating Temperature: 105°C; Package Quantity: 4000; Packaging: Tape and Reel; Max Current Rating: 500mA; Length: 0.063inch; Width: 0.031inch; Height: 0.037inch; RoHS Compliant: Yes; ComponentLink1URL: https://productfinder.pulseeng.com/doc_type/WEB301/doc_num/WC706/doc_part/WC706.pdf?src-supplier=Digi-Key; ComponentLink1Description: https://productfinder.pulseeng.com/doc_type/WEB301/doc_num/WC706/doc_part/WC706.pdf?src-supplier=Digi-Key; ComponentLink2URL: http://productfinder.pulseeng.com/products/datasheets/WC706.pdf?src-supplier=Digi-Key; ComponentLink2Description: http://productfinder.pulseeng.com/products/datasheets/WC706.pdf?src-supplier=Digi-Key; LCSC PN: C275486
HA1 HB1 = DF40-100DS RCPT_1: 100 Position Connector Receptacle, Center Strip Contacts Surface Mount Gold; MF: Hirose; MP: DF40C-100DS-0.4V(51); SnapEDA_Link: https://www.snapeda.com/parts/DF40C-100DS-0.4V(51)/Hirose/view-part/?ref=snap; Package: None; Value: *; Check_prices: https://www.snapeda.com/parts/DF40C-100DS-0.4V(51)/Hirose/view-part/?ref=eda; LCSC PN: C424649; Supplier 1: Avnet; Supplier Part Number 1: DF40C-100DS-0.4V(5; Supplier 2: Digikey; Supplier Part Number 2: 26-DF40HC(3.0)-100DS-0.4V(51)CT-ND
HDR1 = 10pinMobo: 10pin motherboard jack
J7 = 10018783-10203TLF: 164 Position Female Connector PCI Express™ Gold 0.039" (1.00mm) Black; MF: Amphenol ICC; Package: None; Price: None; Value: *; MP: 10018783-10203TLF; Availability: Unavailable; LCSC PN: C426228; Supplier 1: Avnet; Supplier Part Number 1: 73P6874
J8 = RP-Zero_1: Raspberry Pi Zero/W/2W / Header, debug-pads, & mounting
J9 = BM04B-SRSS-TB: Connector Header Surface Mount 4 position 0.039" (1.00mm); Mfr_Name: JST; Type: Headers, Male Pins; RefDes: RefDes; LCSC PN: C160390
rPI1 = RP-CM5: Compute Module 5 Footprint / Overlap Hirose 100P connector over pads to place actual components

## Sheet USB2_Replication.SchDoc
size B; SheetNumber: 4; SheetTotal: 11
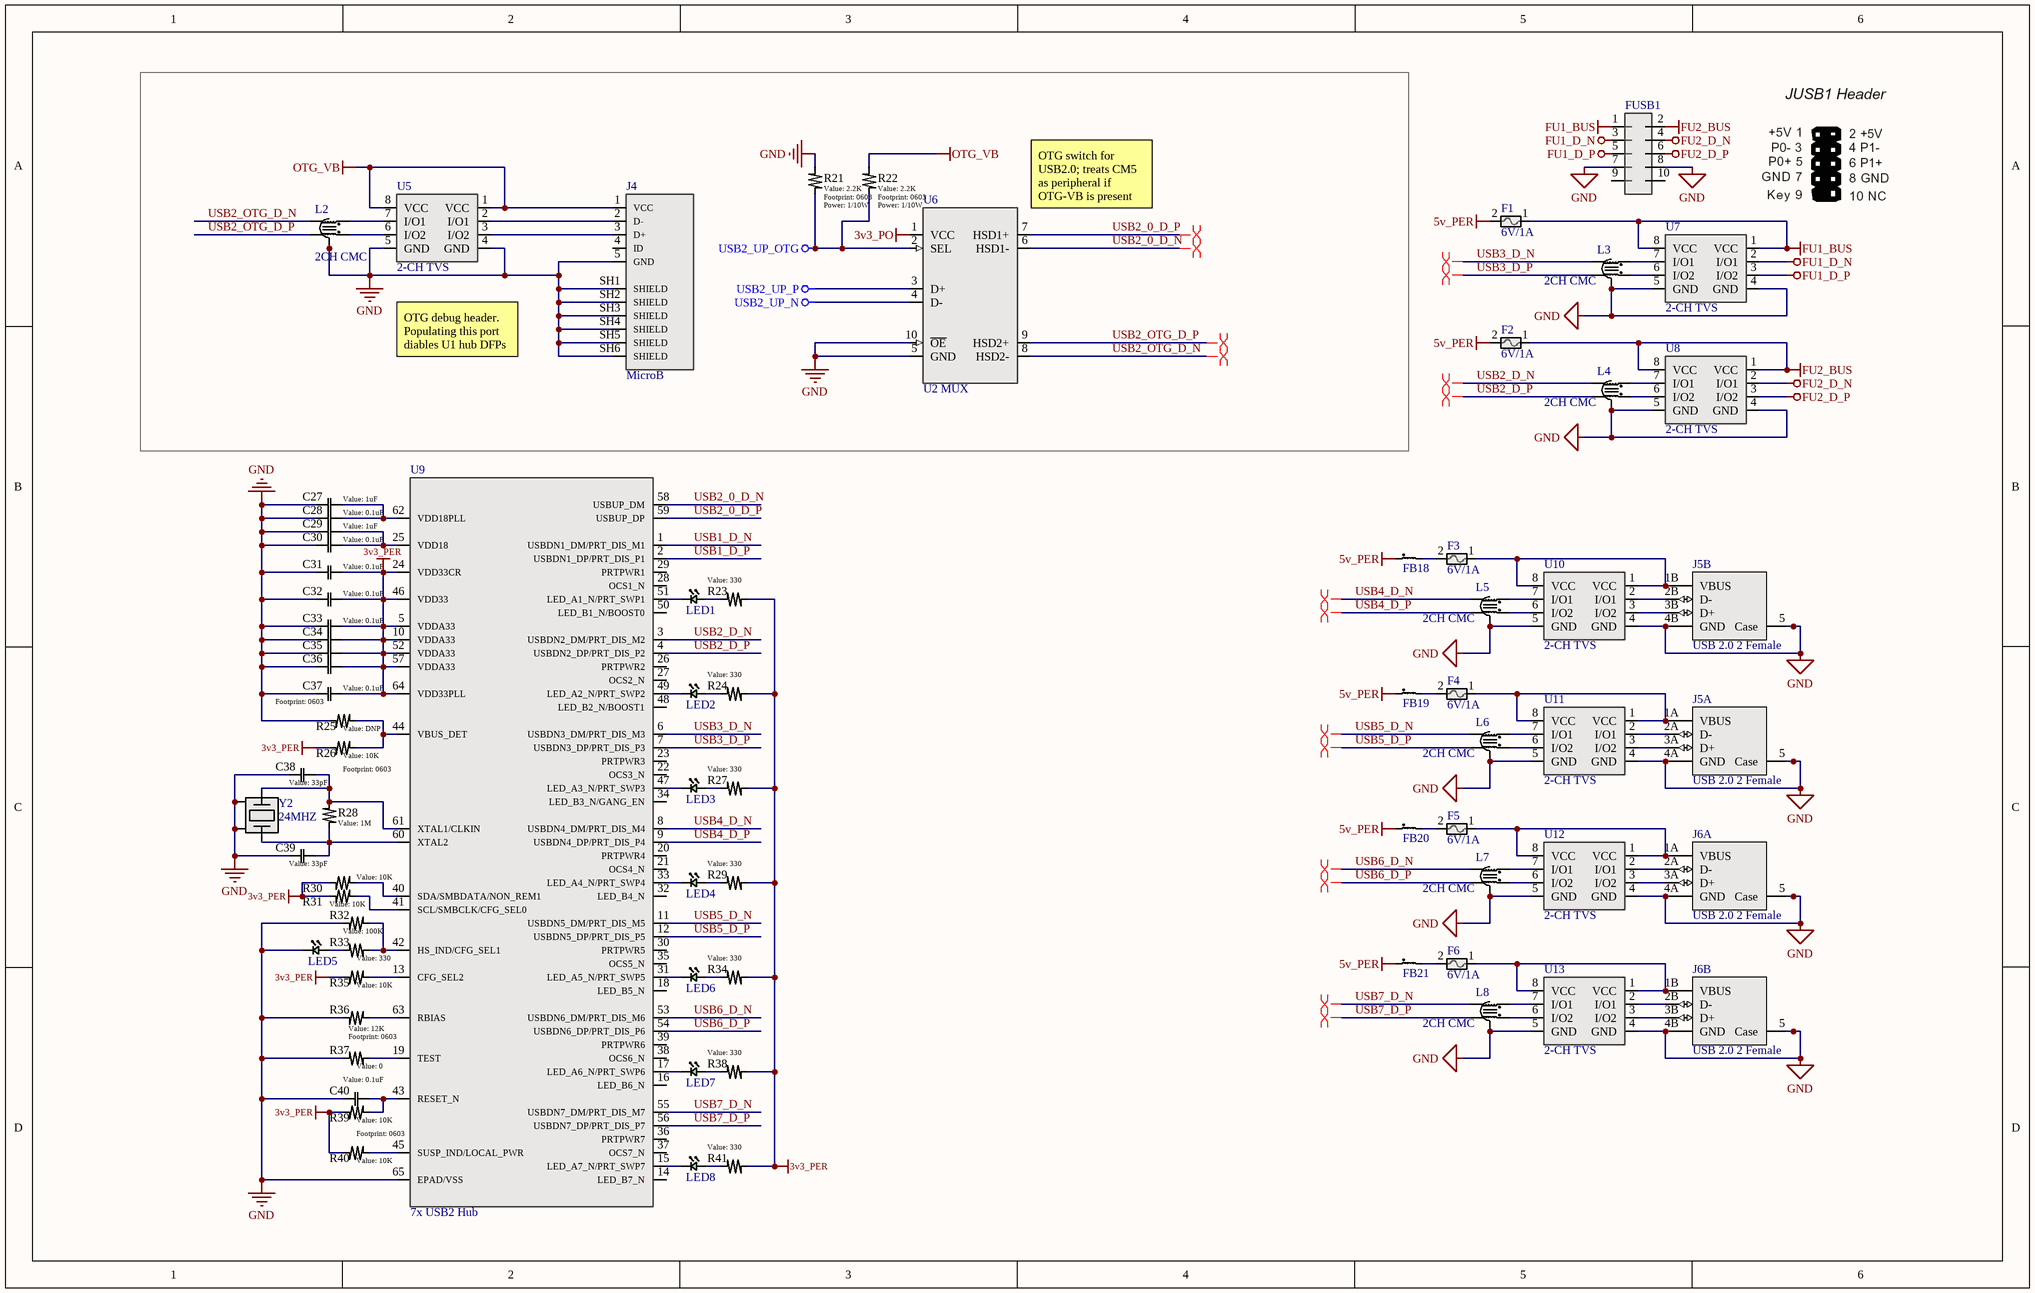
[diagram p2: USB2_Replication.SchDoc]

### Parts
C27  value 1uF  [0603]  (hidden comment: Generic Capacitor)
C28  value 0.1uF  [0603]  (hidden comment: Generic Capacitor)
C29  value 1uF  [0603]  (hidden comment: Generic Capacitor)
C30  value 0.1uF  [0603]  (hidden comment: Generic Capacitor)
C31  value 0.1uF  [0603]  (hidden comment: Generic Capacitor)
C32  value 0.1uF  [0603]  (hidden comment: Generic Capacitor)
C33  value 0.1uF  [0603]  (hidden comment: Generic Capacitor)
C34  Generic Capacitor  [0603]  (value not drawn)
C35  Generic Capacitor  [0603]  (value not drawn)
C36  Generic Capacitor  [0603]  (value not drawn)
C37  value 0.1uF  [0603]  (hidden comment: Generic Capacitor)
C38  value 33pF  [0603]  (hidden comment: Generic Capacitor)
C39  value 33pF  [0603]  (hidden comment: Generic Capacitor)
C40  value 0.1uF  [0603]  (hidden comment: Generic Capacitor)
F1  6V/1A  [0805]
F2  6V/1A  [0805]
F3  6V/1A  [0805]
F4  6V/1A  [0805]
F5  6V/1A  [0805]
F6  6V/1A  [0805]
FB18  0603 Ferrite  [0603]  (value not drawn)
FB19  0603 Ferrite  [0603]  (value not drawn)
FB20  0603 Ferrite  [0603]  (value not drawn)
FB21  0603 Ferrite  [0603]  (value not drawn)
FUSB1  10pinMobo  [10pinMobo]  (value not drawn)
J4  MicroB  [10118194-0001LF]
J5  USB 2.0 2 Female  [907-111A1022D10200]  (parts A,B of 2)
J6  USB 2.0 2 Female  [907-111A1022D10200]  (parts A,B of 2)
L2  2CH CMC  [SMD-6-2CH]
L3  2CH CMC  [SMD-6-2CH]
L4  2CH CMC  [SMD-6-2CH]
L5  2CH CMC  [SMD-6-2CH]
L6  2CH CMC  [SMD-6-2CH]
L7  2CH CMC  [SMD-6-2CH]
L8  2CH CMC  [SMD-6-2CH]
LED1  LTST-C191KGKT  [0603 (1608 Metric) Concave]  (value not drawn)
LED2  LTST-C191KGKT  [0603 (1608 Metric) Concave]  (value not drawn)
LED3  LTST-C191KGKT  [0603 (1608 Metric) Concave]  (value not drawn)
LED4  LTST-C191KGKT  [0603 (1608 Metric) Concave]  (value not drawn)
LED5  LTST-C191KGKT  [0603 (1608 Metric) Concave]  (value not drawn)
LED6  LTST-C191KGKT  [0603 (1608 Metric) Concave]  (value not drawn)
LED7  LTST-C191KGKT  [0603 (1608 Metric) Concave]  (value not drawn)
LED8  LTST-C191KGKT  [0603 (1608 Metric) Concave]  (value not drawn)
R21  value 2.2K  Power: 1/10W  [0603]  (hidden comment: Generic Resistor)
R22  value 2.2K  Power: 1/10W  [0603]  (hidden comment: Generic Resistor)
R23  value 330  [0603]  (hidden comment: Generic Resistor)
R24  value 330  [0603]  (hidden comment: Generic Resistor)
R25  value DNP  [0603]  (hidden comment: Generic Resistor)
R26  value 10K  [0603]  (hidden comment: Generic Resistor)
R27  value 330  [0603]  (hidden comment: Generic Resistor)
R28  value 1M  [0603]  (hidden comment: Generic Resistor)
R29  value 330  [0603]  (hidden comment: Generic Resistor)
R30  value 10K  [0603]  (hidden comment: Generic Resistor)
R31  value 10K  [0603]  (hidden comment: Generic Resistor)
R32  value 100K  [0603]  (hidden comment: Generic Resistor)
R33  value 330  [0603]  (hidden comment: Generic Resistor)
R34  value 330  [0603]  (hidden comment: Generic Resistor)
R35  value 10K  [0603]  (hidden comment: Generic Resistor)
R36  value 12K  [0603]  (hidden comment: Generic Resistor)
R37  value 0  [0603]  (hidden comment: Generic Resistor)
R38  value 330  [0603]  (hidden comment: Generic Resistor)
R39  value 10K  [0603]  (hidden comment: Generic Resistor)
R40  value 10K  [0603]  (hidden comment: Generic Resistor)
R41  value 330  [0603]  (hidden comment: Generic Resistor)
U5  2-CH TVS  [8-SOIC]
U6  U2 MUX  [MSOP-10]
U7  2-CH TVS  [8-SOIC]
U8  2-CH TVS  [8-SOIC]
U9  7x USB2 Hub  [QFN-64]
U10  2-CH TVS  [8-SOIC]
U11  2-CH TVS  [8-SOIC]
U12  2-CH TVS  [8-SOIC]
U13  2-CH TVS  [8-SOIC]
Y2  24MHZ  [SMD2520-4P]

### Nets
3v3_PER: C31.1 C32.1 C33.1 C34.1 C35.1 C36.1 C37.1 R23.2 R24.2 R26.1 R27.2 R29.2 R30.1 R31.1 R34.2 R35.1 R38.2 R39.1 R40.1 R41.2 U9.5(VDDA33) U9.10(VDDA33) U9.24(VDD33CR) U9.46(VDD33) U9.52(VDDA33) U9.57(VDDA33) U9.64(VDD33PLL)
3v3_PO: U6.1(VCC)
5v_PER: F1.2 F2.2 FB18.1 FB19.1 FB20.1 FB21.1
FU1_BUS: F1.1 FUSB1.1 U7.1(VCC) U7.8(VCC)
FU1_D_N: FUSB1.3 U7.2(I/O1)
FU1_D_P: FUSB1.5 U7.3(I/O2)
FU2_BUS: F2.1 FUSB1.2 U8.1(VCC) U8.8(VCC)
FU2_D_N: FUSB1.4 U8.2(I/O1)
FU2_D_P: FUSB1.6 U8.3(I/O2)
GND: C27.2 C28.2 C29.2 C30.2 C31.2 C32.2 C33.2 C34.2 C35.2 C36.2 C37.2 C38.2 C39.2 C40.2 FUSB1.7 FUSB1.8 J4.5(GND) J4.SH1(SHIELD) J4.SH2(SHIELD) J4.SH3(SHIELD) J4.SH4(SHIELD) J4.SH5(SHIELD) J4.SH6(SHIELD) J5.4A(GND) J5.4B(GND) J5.5(Case) J6.4A(GND) J6.4B(GND) J6.5(Case) L2.5 L2.6 L3.5 L3.6 L4.5 L4.6 L5.5 L5.6 L6.5 L6.6 L7.5 L7.6 L8.5 L8.6 LED5.1(Cathode) R21.1 R25.1 R32.1 R36.1 R37.1 U5.4(GND) U5.5(GND) U6.5(GND) U6.10(~{OE}) U7.4(GND) U7.5(GND) U8.4(GND) U8.5(GND) U9.65(EPAD/VSS) U10.4(GND) U10.5(GND) U11.4(GND) U11.5(GND) U12.4(GND) U12.5(GND) U13.4(GND) U13.5(GND) Y2.2(GND) Y2.4(GND)
OTG_VB: J4.1(VCC) R22.1 U5.1(VCC) U5.8(VCC)
USB2_UP_N: U6.4(D-)
USB2_UP_OTG: R21.2 R22.2 U6.2(SEL)
USB2_UP_P: U6.3(D+)
USB1_D_N: U9.1(USBDN1_DM/PRT_DIS_M1)
USB1_D_P: U9.2(USBDN1_DP/PRT_DIS_P1)
USB2_0_D_N: U6.6(HSD1-) U9.58(USBUP_DM)
USB2_0_D_P: U6.7(HSD1+) U9.59(USBUP_DP)
USB2_D_N: L4.4 U9.3(USBDN2_DM/PRT_DIS_M2)
USB2_D_P: L4.3 U9.4(USBDN2_DP/PRT_DIS_P2)
USB2_OTG_D_N: L2.4 U6.8(HSD2-)
USB2_OTG_D_P: L2.3 U6.9(HSD2+)
USB3_D_N: L3.4 U9.6(USBDN3_DM/PRT_DIS_M3)
USB3_D_P: L3.3 U9.7(USBDN3_DP/PRT_DIS_P3)
USB4_D_N: L5.4 U9.8(USBDN4_DM/PRT_DIS_M4)
USB4_D_P: L5.3 U9.9(USBDN4_DP/PRT_DIS_P4)
USB5_D_N: L6.4 U9.11(USBDN5_DM/PRT_DIS_M5)
USB5_D_P: L6.3 U9.12(USBDN5_DP/PRT_DIS_P5)
USB6_D_N: L7.4 U9.53(USBDN6_DM/PRT_DIS_M6)
USB6_D_P: L7.3 U9.54(USBDN6_DP/PRT_DIS_P6)
USB7_D_N: L8.4 U9.55(USBDN7_DM/PRT_DIS_M7)
USB7_D_P: L8.3 U9.56(USBDN7_DP/PRT_DIS_P7)
NetC27_1: C27.1 C28.1 U9.62(VDD18PLL)
NetC29_1: C29.1 C30.1 U9.25(VDD18)
NetC38_1: C38.1 R28.1 U9.61(XTAL1/CLKIN) Y2.1
NetC39_1: C39.1 R28.2 U9.60(XTAL2) Y2.3
NetC40_1: C40.1 R39.2 U9.43(RESET_N)
NetF3_1: F3.1 J5.1B(VBUS) U10.1(VCC) U10.8(VCC)
NetF3_2: F3.2 FB18.2
NetF4_1: F4.1 J5.1A(VBUS) U11.1(VCC) U11.8(VCC)
NetF4_2: F4.2 FB19.2
NetF5_1: F5.1 J6.1A(VBUS) U12.1(VCC) U12.8(VCC)
NetF5_2: F5.2 FB20.2
NetF6_1: F6.1 J6.1B(VBUS) U13.1(VCC) U13.8(VCC)
NetF6_2: F6.2 FB21.2
NetJ4_2: J4.2(D-) U5.2(I/O1)
NetJ4_3: J4.3(D+) U5.3(I/O2)
NetJ5_2A: J5.2A(D-) U11.2(I/O1)
NetJ5_2B: J5.2B(D-) U10.2(I/O1)
NetJ5_3A: J5.3A(D+) U11.3(I/O2)
NetJ5_3B: J5.3B(D+) U10.3(I/O2)
NetJ6_2A: J6.2A(D-) U12.2(I/O1)
NetJ6_2B: J6.2B(D-) U13.2(I/O1)
NetJ6_3A: J6.3A(D+) U12.3(I/O2)
NetJ6_3B: J6.3B(D+) U13.3(I/O2)
NetL2_1: L2.1 U5.7(I/O1)
NetL2_2: L2.2 U5.6(I/O2)
NetL3_1: L3.1 U7.7(I/O1)
NetL3_2: L3.2 U7.6(I/O2)
NetL4_1: L4.1 U8.7(I/O1)
NetL4_2: L4.2 U8.6(I/O2)
NetL5_1: L5.1 U10.7(I/O1)
NetL5_2: L5.2 U10.6(I/O2)
NetL6_1: L6.1 U11.7(I/O1)
NetL6_2: L6.2 U11.6(I/O2)
NetL7_1: L7.1 U12.7(I/O1)
NetL7_2: L7.2 U12.6(I/O2)
NetL8_1: L8.1 U13.7(I/O1)
NetL8_2: L8.2 U13.6(I/O2)
NetLED1_1: LED1.1(Cathode) U9.51(LED_A1_N/PRT_SWP1)
NetLED1_2: LED1.2(Anode) R23.1
NetLED2_1: LED2.1(Cathode) U9.49(LED_A2_N/PRT_SWP2)
NetLED2_2: LED2.2(Anode) R24.1
NetLED3_1: LED3.1(Cathode) U9.47(LED_A3_N/PRT_SWP3)
NetLED3_2: LED3.2(Anode) R27.1
NetLED4_1: LED4.1(Cathode) U9.33(LED_A4_N/PRT_SWP4)
NetLED4_2: LED4.2(Anode) R29.1
NetLED5_2: LED5.2(Anode) R33.1
NetLED6_1: LED6.1(Cathode) U9.31(LED_A5_N/PRT_SWP5)
NetLED6_2: LED6.2(Anode) R34.1
NetLED7_1: LED7.1(Cathode) U9.17(LED_A6_N/PRT_SWP6)
NetLED7_2: LED7.2(Anode) R38.1
NetLED8_1: LED8.1(Cathode) U9.15(LED_A7_N/PRT_SWP7)
NetLED8_2: LED8.2(Anode) R41.1
NetR25_2: R25.2 R26.2 U9.44(VBUS_DET)
NetR30_2: R30.2 U9.40(SDA/SMBDATA/NON_REM1)
NetR31_2: R31.2 U9.41(SCL/SMBCLK/CFG_SEL0)
NetR32_2: R32.2 R33.2 U9.42(HS_IND/CFG_SEL1)
NetR35_2: R35.2 U9.13(CFG_SEL2)
NetR36_2: R36.2 U9.63(RBIAS)
NetR37_2: R37.2 U9.19(TEST)
NetR40_2: R40.2 U9.45(SUSP_IND/LOCAL_PWR)

Not connected (* = marked no-connect by the designer): FUSB1 9 10; J4 4(ID); U9 14(LED_B7_N) 16(LED_B6_N) 18(LED_B5_N) 20(PRTPWR4) 21(OCS4_N) 22(OCS3_N) 23(PRTPWR3) 26(PRTPWR2) 27(OCS2_N) 28(OCS1_N) 29(PRTPWR1) 30(PRTPWR5) 32(LED_B4_N) 34(LED_B3_N/GANG_EN) 35(OCS5_N) 36(PRTPWR7) 37(OCS7_N) 38(OCS6_N) 39(PRTPWR6) 48(LED_B2_N/BOOST1) 50(LED_B1_N/BOOST0)

### Layout directives
differential pair: USB2_0_D_N, USB2_0_D_P, USB2_D_N, USB2_D_P, USB2_OTG_D_N, USB2_OTG_D_P, USB3_D_N, USB3_D_P, USB4_D_N, USB4_D_P, USB5_D_N, USB5_D_P, USB6_D_N, USB6_D_P, USB7_D_N, USB7_D_P

### Notes on the sheet
- (near U6) OTG switch for USB2.0; treats CM5 as peripheral if OTG-VB is present
- OTG debug header. Populating this port diables U1 hub DFPs
- REV
- REVISIONS
- DATE
- DESCRIPTION
- BY
- UNLESS OTHERWISE SPECIFIED, DRAWING DEFINITIONS AND TOLERANCES SHALL BE FOUND UNDER SUPPLIER STANDARDS SS-001. THIS PART AND ALL COMPONENTS OF IT MUST BE RoHS & REACH COMPLIANT. A CERTIFICATE OF COMPLIANCE MUST BE PROVIDED UPON REQUEST.
- ALL INFORMATION ON THIS DOCUMENT IS THE SOLE PROPERTY OF GAMBER-JOHNSON AND SHALL NOT BE COPIED, REPRODUCED, USED OR DISCLOSED IN WHOLE OR IN PART WITHOUT THE WRITTEN CONSENT OF GAMBER-JOHNSON
- TOLERANCES
  .00 ± .060
  .000 ± .020
  .0000 ± .005
  ANGELS ± 1°
- DRAWN BY:
- PROJECT NUMBER:
- SHEET TITLE:
- SHEET
- OF
- DATE:
- LOCATION:
- ASSEMBLY NUMBER
- SIZE
- GAMBER-JOHNSON LLC
  5001 JOERNS DR.
  STEVENS POINT, WI 54481
  +1 (715) 344-5209
- B

### Library data of the parts
C27-C33 C37-C40 = Generic Capacitor: Voltage: 10V; Tolerance: 10%
C34-C36 = Generic Capacitor: Voltage: 10V; Tolerance: 10%; Value: 0.1uF
F1-F6 = 0ZCK0100FF2E: Polymeric PTC Resettable Fuse 6V 1 A Ih Surface Mount 0805 (2012 Metric), Concave; Manufacturer: Bel; Max Current Rating: 40A; Hold Current: 1A; Trip Current: 1.95A; Time to Trip: 0.3s; Supplier 1: Digi-Key; Supplier Part Number 1: 507-1815-1-ND; Manufacturer Part Number: 0ZCK0100FF2E; RoHS: Yes; Category: PTC Resettable Fuses; Stock 1: 74738; Pricing 1: 1=0.27000, 5=0.26600, 10=0.25400, 50=0.22620, 100=0.21060, 250=0.18720, 500=0.15600, 1000=0.14820 (USD); Mount: Surface Mount; Case/Package: 0805; Case Code (Metric): 2012; Case Code (Imperial): 0805; Contact Plating: Tin,Matte; Min Operating Temperature: -40°C; Max Operating Temperature: 85°C; Package Quantity: 1; Packaging: Tape and Reel; RoHS Compliant: Yes; ComponentLink1URL: https://datasheet.ciiva.com/18550/0zck-18550620.pdf?src-supplier=Digi-Key; ComponentLink1Description: https://datasheet.ciiva.com/18550/0zck-18550620.pdf?src-supplier=Digi-Key; ComponentLink2URL: https://datasheet.ciiva.com/18550/0zck-18550621.pdf?src-supplier=Digi-Key; ComponentLink2Description: https://datasheet.ciiva.com/18550/0zck-18550621.pdf?src-supplier=Digi-Key; ComponentLink3URL: https://datasheet.ciiva.com/18550/0zck-18550622.pdf?src-supplier=Digi-Key; ComponentLink3Description: https://datasheet.ciiva.com/18550/0zck-18550622.pdf?src-supplier=Digi-Key; LCSC PN: C883112
FB18-FB21 = PE-0603FB121ST: as FB22 on sheet Docking_Connection; Supplier 1: Digi-Key; Supplier Part Number 1: 553-2382-1-ND; Manufacturer Part Number: PE-0603FB121ST; RoHS: Yes; Category: Inductors; Stock 1: 6181; Pricing 1: 1=0.10000, 10=0.04400, 25=0.03920, 50=0.03580, 100=0.03220, 250=0.02360, 500=0.01716, 1000=0.01680 (USD); Mount: Surface Mount; Case/Package: 0603; Case Code (Metric): 1608; Case Code (Imperial): 0603; Min Operating Temperature: -40°C; Max Operating Temperature: 105°C; Package Quantity: 4000; Packaging: Tape and Reel; Max Current Rating: 500mA; Length: 0.063inch; Width: 0.031inch; Height: 0.037inch; RoHS Compliant: Yes; ComponentLink1URL: https://productfinder.pulseeng.com/doc_type/WEB301/doc_num/WC706/doc_part/WC706.pdf?src-supplier=Digi-Key; ComponentLink1Description: https://productfinder.pulseeng.com/doc_type/WEB301/doc_num/WC706/doc_part/WC706.pdf?src-supplier=Digi-Key; ComponentLink2URL: http://productfinder.pulseeng.com/products/datasheets/WC706.pdf?src-supplier=Digi-Key; ComponentLink2Description: http://productfinder.pulseeng.com/products/datasheets/WC706.pdf?src-supplier=Digi-Key; LCSC PN: C275486
FUSB1 = 10pinMobo: 10pin motherboard jack
J4 = 10118194-0001LF: Micro USB, Input Output Connectors, B TYPE RECEPTACLE with flange; MF: Amphenol ICC; SnapEDA_Link: https://www.snapeda.com/parts/10118194-0001LF/Amphenol+FCI/view-part/?ref=snap; Package: None; Value: *; MP: 10118194-0001LF; Check_prices: https://www.snapeda.com/parts/10118194-0001LF/Amphenol+FCI/view-part/?ref=eda; LCSC PN: C132563
J5 J6 = 907-111A1022D10200: USB 2.0 2 8 Female Type-A Plugin USB Connectors ROHS; LCSC PN: C12049
L2-L8 = ICMEF112P350MFR: 35Ω@100MHz -40℃~+85℃ 4Ω 5V 2 100mA SMD Common Mode Filters ROHS; LCSC PN: C396460; Supplier 1: Mouser; Supplier Part Number 1: 710-748020024
LED1-LED8 = CMP-013-000000-1: LED Uni-Color Green 574nm 2-Pin Chip LED T/R; Manufacturer 1: Vishay Lite-On; Number of Elements: 1; Viewing Angle: 130°; Lens Transparency: Clear; Power Dissipation: 75mW; Test Current: 20mA; Lens Style: Rectangular,Colorless; Reverse Voltage: 5V; Lens Color: Colorless; Forward Current: 30mA; Dominant Wavelength: 571nm; Forward Voltage: 2V; Luminous Intensity: 35mcd; Case Code (Imperial): 0603; Width: 0.8mm; Depth: 0.8mm; Case Code (Metric): 1608; Packaging: Tape and Reel; Number of LEDs: 1; Lead Free: Lead Free; Package Quantity: 1; Illumination Color: Green; Design Item ID: LTST-C191KGKT; Color: Green; Mount: Surface Mount; Source: Diodes.SchLib; Radiation Hardening: No; Wavelength: 574nm; RoHS: Yes; Max Power Dissipation: 75mW; RoHS Compliant: Yes; Power Rating: 75mW; Case/Package: 0603; Length: 1.6mm; Component Type: Standard; Number of Pins: 2; Height: 0.55mm; Stock 1: 4150; Pin Count: 2; ComponentLink1Description: https://datasheet.ciiva.com/2109/ltst-c191kgkt-2109973.pdf?src-supplier=Digi-Key; Manufacturer Part Number 1: LTST-C191KGKT; Category: LEDs; Min Operating Temperature: -55°C; ComponentLink1URL: https://datasheet.ciiva.com/2109/ltst-c191kgkt-2109973.pdf?src-supplier=Digi-Key; Max Operating Temperature: 85°C; Pricing 1: 50=0.14800, 250=0.06800, 500=0.06400, 1250=0.05400, 2500=0.05100 (USD)
R21 R22 = Generic Resistor: Tolerance: 1%
R23-R41 = Generic Resistor: Tolerance: 1%; Power: 1/10W
U5 U7 U8 U10-U13 = USB6B1RL: TVS DIODE 5.25VWM 8-SOIC; Mfr_Name: STMicroelectronics; RefDes: RefDes; Type: Type; Supplier 1: Future Electronics; Supplier Part Number 1: 5702279; LCSC PN: C10508
U6 = FSUSB42MUX: FSUSB42 Series DPDT 4.3 V 480 Mbps SMT Hi Speed USB 2.0 Switch - MSOP-10; MF: ON Semiconductor; SnapEDA_Link: https://www.snapeda.com/parts/FSUSB42MUX/Onsemi/view-part/?ref=snap; Package: MSOP-10 ON Semiconductor; Value: *; MP: FSUSB42MUX; Check_prices: https://www.snapeda.com/parts/FSUSB42MUX/Onsemi/view-part/?ref=eda; LCSC PN: C11355; Supplier 1: Digikey; Supplier Part Number 1: FSUSB42MUXCT-ND
U9 = USB2517-JZX: USB Hub Controller USB 2.0 USB Interface 64-QFN (9x9); Mfr_Name: Microchip; RefDes: RefDes; Type: Type; LCSC PN: C1521556; Supplier 1: Avnet; Supplier Part Number 1: USB2517I-JZX; Supplier 2: Newark; Supplier Part Number 2: 66W2139; Supplier 3: Newark; Supplier Part Number 3: 41AH8631
Y2 = CM4024M00020001: 24MHz 20pF ±10ppm ±30ppm SMD-2520-4P Crystals ROHS; LCSC PN: C284163

## Sheet USB_Audio.SchDoc
size A; DrawnBy: KEW; Revision: X1; SheetNumber: 5; SheetTotal: 11; RevisionDate: 9/6/2024; RevisionDescription: First Rev; RevisionEngineer: KEW; ProjectTitle: Front USB-Audio; CompanyName: Gamber-Johnson LLC; Organization: CD Cell; Application_BuildNumber: TBD
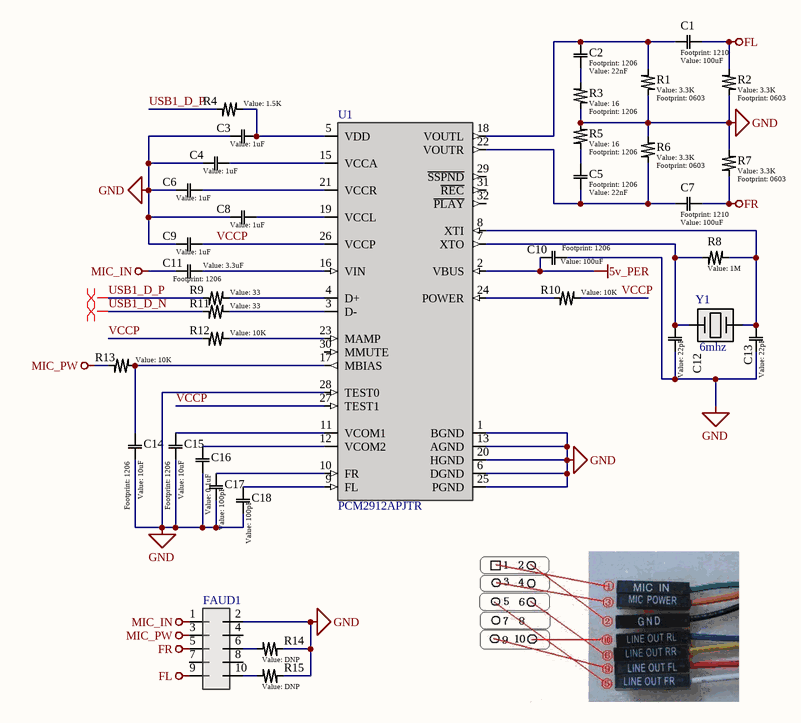
[diagram p3: USB_Audio.SchDoc]

### Parts
C1  value 100uF  [1210]  (hidden comment: Generic Capacitor)
C2  value 22nF  [1206]  (hidden comment: Generic Capacitor)
C3  value 1uF  [0603]  (hidden comment: Generic Capacitor)
C4  value 1uF  [0603]  (hidden comment: Generic Capacitor)
C5  value 22nF  [1206]  (hidden comment: Generic Capacitor)
C6  value 1uF  [0603]  (hidden comment: Generic Capacitor)
C7  value 100uF  [1210]  (hidden comment: Generic Capacitor)
C8  value 1uF  [0603]  (hidden comment: Generic Capacitor)
C9  value 1uF  [0603]  (hidden comment: Generic Capacitor)
C10  value 100uF  [1206]  (hidden comment: Generic Capacitor)
C11  value 3.3uF  [1206]  (hidden comment: Generic Capacitor)
C12  value 22pF  [0603]  (hidden comment: Generic Capacitor)
C13  value 22pF  [0603]  (hidden comment: Generic Capacitor)
C14  value 10uF  [1206]  (hidden comment: Generic Capacitor)
C15  value 10uF  [1206]  (hidden comment: Generic Capacitor)
C16  value 0.1uF  [0603]  (hidden comment: Generic Capacitor)
C17  value 100pF  [0603]  (hidden comment: Generic Capacitor)
C18  value 100pF  [0603]  (hidden comment: Generic Capacitor)
FAUD1  10pinMobo  [10pinMobo]  (value not drawn)
R1  value 3.3K  [0603]  (hidden comment: Generic Resistor)
R2  value 3.3K  [0603]  (hidden comment: Generic Resistor)
R3  value 16  [1206]  (hidden comment: Generic Resistor)
R4  value 1.5K  [0603]  (hidden comment: Generic Resistor)
R5  value 16  [1206]  (hidden comment: Generic Resistor)
R6  value 3.3K  [0603]  (hidden comment: Generic Resistor)
R7  value 3.3K  [0603]  (hidden comment: Generic Resistor)
R8  value 1M  [0603]  (hidden comment: Generic Resistor)
R9  value 33  [0603]  (hidden comment: Generic Resistor)
R10  value 10K  [0603]  (hidden comment: Generic Resistor)
R11  value 33  [0603]  (hidden comment: Generic Resistor)
R12  value 10K  [0603]  (hidden comment: Generic Resistor)
R13  value 10K  [0603]  (hidden comment: Generic Resistor)
R14  value DNP  [0603]  (hidden comment: Generic Resistor)
R15  value DNP  [0603]  (hidden comment: Generic Resistor)
U1  PCM2912APJTR  [32-TQFP]
Y1  6mhz  [HC-49S-SMD]

### Nets
5v_PER: C10.1 U1.2(VBUS)
FL: C1.1 FAUD1.9 R2.2
FR: C7.1 FAUD1.5 R7.2
GND: C3.1 C4.1 C6.1 C8.1 C9.1 C10.2 C12.2 C13.2 C14.2 C15.2 C16.2 C17.2 C18.2 FAUD1.2 R1.1 R2.1 R3.1 R5.1 R6.1 R7.1 R14.1 R15.1 U1.1(BGND) U1.6(DGND) U1.13(AGND) U1.20(HGND) U1.25(PGND) U1.28(TEST0)
MIC_IN: C11.2 FAUD1.1
MIC_PW: FAUD1.3 R13.2
USB1_D_N: R11.2
USB1_D_P: R4.2 R9.2
VCCP: C9.2 R10.1 R12.2 U1.26(VCCP) U1.27(TEST1)
NetC1_2: C1.2 C2.1 R1.2 U1.18(VOUTL)
NetC2_2: C2.2 R3.2
NetC3_2: C3.2 R4.1 U1.5(VDD)
NetC4_2: C4.2 U1.15(VCCA)
NetC5_1: C5.1 C7.2 R6.2 U1.22(VOUTR)
NetC5_2: C5.2 R5.2
NetC6_2: C6.2 U1.21(VCCR)
NetC8_2: C8.2 U1.19(VCCL)
NetC11_1: C11.1 U1.16(VIN)
NetC12_1: C12.1 R8.1 U1.7(XTO) Y1.1
NetC13_1: C13.1 R8.2 U1.8(XTI) Y1.2
NetC14_1: C14.1 R13.1 U1.17(MBIAS)
NetC15_1: C15.1 U1.11(VCOM1)
NetC16_1: C16.1 U1.12(VCOM2)
NetC17_1: C17.1 U1.10(FR)
NetC18_1: C18.1 U1.9(FL)
NetFAUD1_6: FAUD1.6 R14.2
NetFAUD1_10: FAUD1.10 R15.2
NetR9_1: R9.1 U1.4(D+)
NetR10_2: R10.2 U1.24(POWER)
NetR11_1: R11.1 U1.3(D-)
NetR12_1: R12.1 U1.23(MAMP)

Not connected (* = marked no-connect by the designer): FAUD1 4 7 8; U1 29(~{SSPND}) 30(MMUTE) 31(~{REC}) 32(~{PLAY})

### Layout directives
differential pair: USB1_D_N, USB1_D_P

### Notes on the sheet
- REV
- REVISIONS
- DATE
- DESCRIPTION
- BY
- UNLESS OTHERWISE SPECIFIED, DRAWING DEFINITIONS AND TOLERANCES SHALL BE FOUND UNDER SUPPLIER STANDARDS SS-001. THIS PART AND ALL COMPONENTS OF IT MUST BE RoHS & REACH COMPLIANT. A CERTIFICATE OF COMPLIANCE MUST BE PROVIDED UPON REQUEST.
- ALL INFORMATION ON THIS DOCUMENT IS THE SOLE PROPERTY OF GAMBER-JOHNSON AND SHALL NOT BE COPIED, REPRODUCED, USED OR DISCLOSED IN WHOLE OR IN PART WITHOUT THE WRITTEN CONSENT OF GAMBER-JOHNSON
- TOLERANCES
  .00 ± .060
  .000 ± .020
  .0000 ± .005
  ANGELS ± 1°
- DRAWN BY:
- PROJECT NUMBER:
- SHEET TITLE:
- SHEET
- OF
- DATE:
- LOCATION:
- ASSEMBLY NUMBER
- SIZE
- GAMBER-JOHNSON LLC
  5001 Joerns Dr
  STEVENS POINT, WI 54481
  +1 (715) 344-5209
- A

### Library data of the parts
C1-C18 = Generic Capacitor: Voltage: >10V; Tolerance: 10%
FAUD1 = 10pinMobo: 10pin motherboard jack
R1-R15 = Generic Resistor: Tolerance: 1%; Power: 1/10W
U1 = PCM2912APJTR: Audio CODEC with USB Interface, Mono Microphone Input and Stereo Headphone Output 32-TQFP -25 to 85; MF: Texas Instruments; MP: PCM2912APJTR; Price: None; DigiKey-Purchase-URL: https://snapeda.com/shop?store=DigiKey&id=574055; Package: TQFP-32 Texas Instruments; Texas_Instruments-Purchase-URL: https://snapeda.com/shop?store=Texas+Instruments&id=574055; Value: *; Availability: Unavailable; Mouser-Purchase-URL: https://snapeda.com/shop?store=Mouser&id=574055; SnapEDA_Link: https://www.snapeda.com/parts/PCM2912APJTR/Texas%20Instruments/view-part/574055/?ref=snap; LCSC PN: C475497
Y1 = H6OEL89CSC-SUGYLC-6M: 6MHz Surface Mount Crystal 20pF ±20ppm ±30ppm HC-49S-SMD Crystals; LCSC PN: C7528811